# EAGLE board audio_board (EAGLE 6.3)
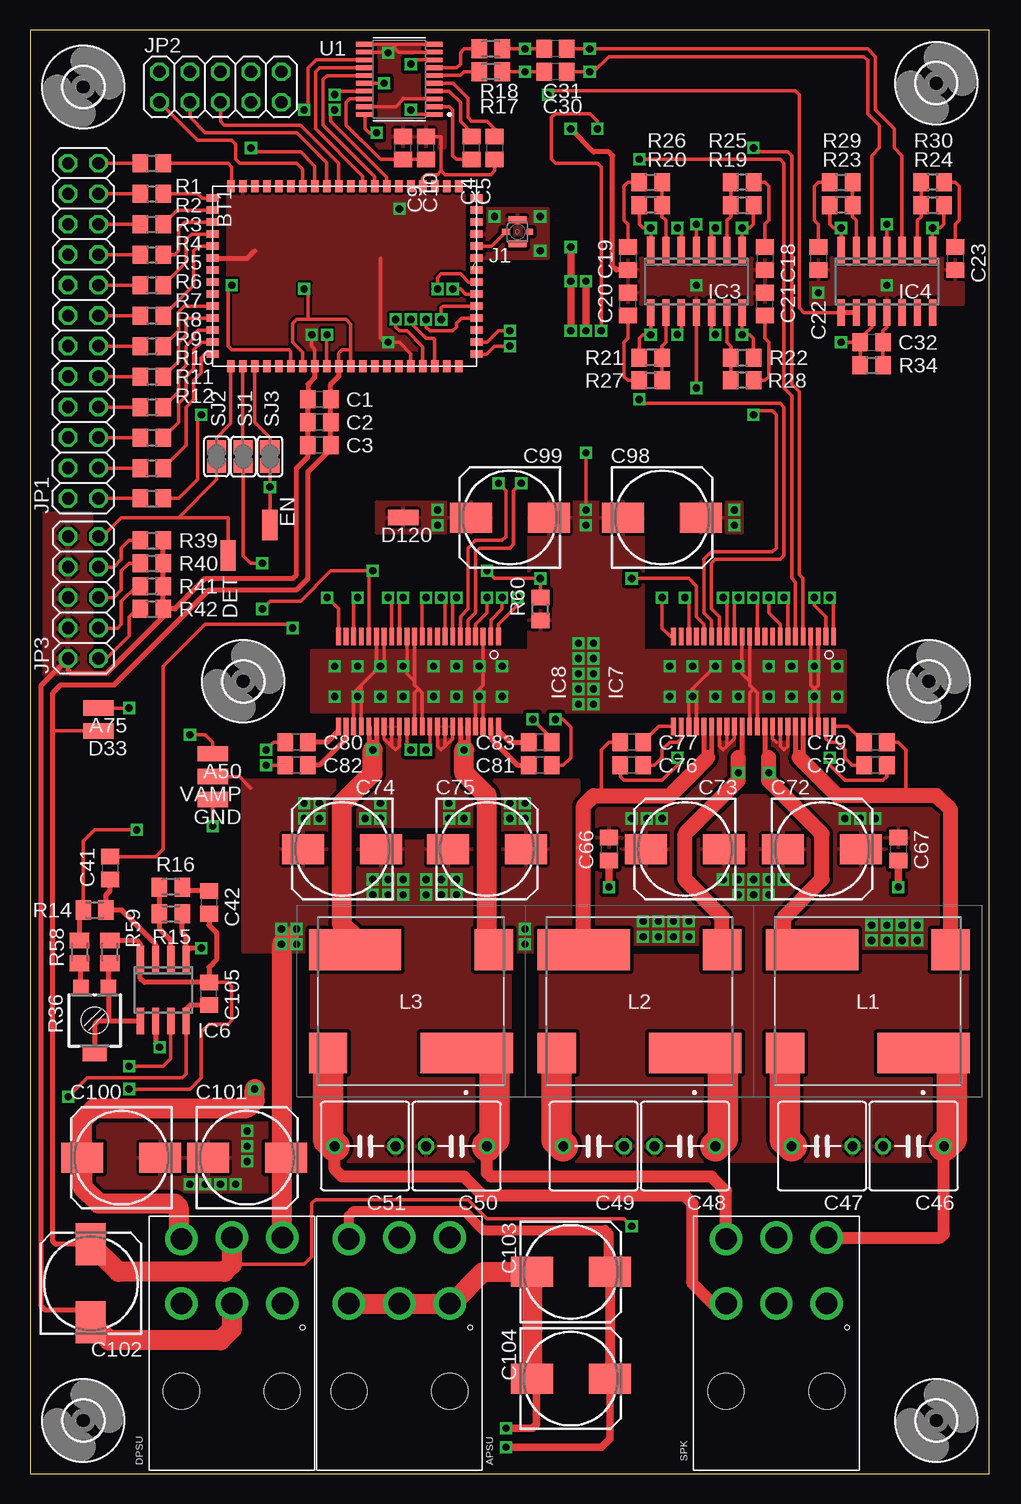
[diagram p6: board, top side]
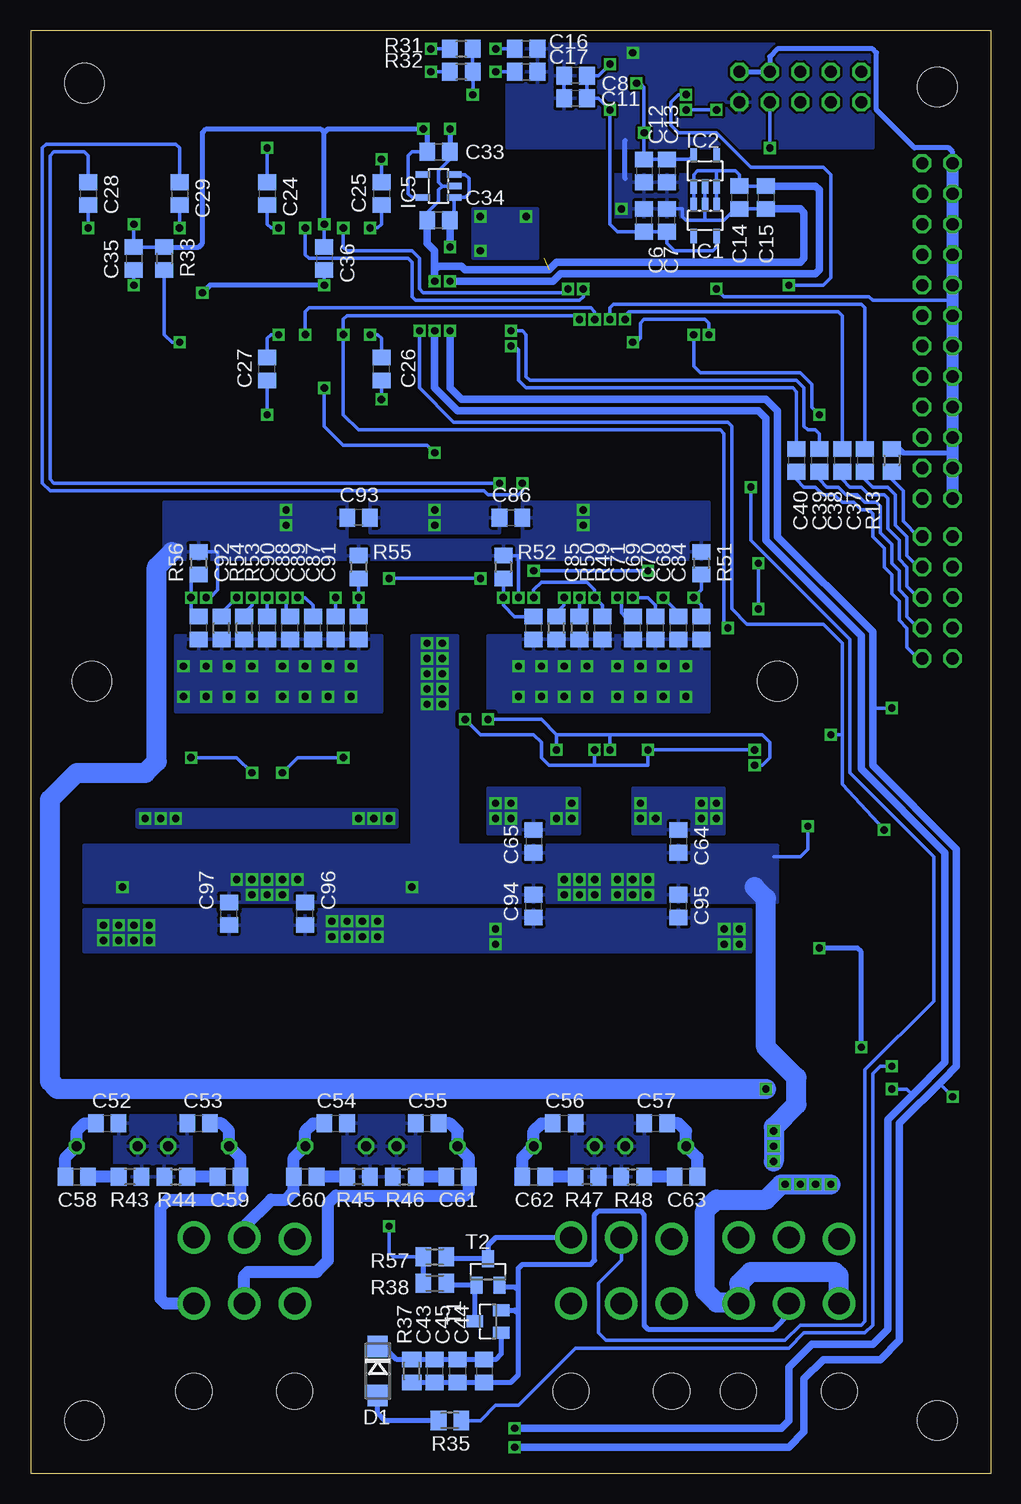
[diagram p7: board, bottom side, seen from below]

Size 79.99 x 120.32 mm. Coordinates in mm from the lower left corner, seen from the top.
Outline: 0,0 79.99,0 79.99,120.32 0,120.32 0,0
Copper layers (1*16): Top 0.035mm / dielectric 1.5mm / Bottom 0.035mm
Design rules "default": minimum track width 10mil, minimum drill 24mil, track to track 8mil, track to pad 8mil, pad to pad 8mil, via to via 8mil, smd to smd 8mil, copper to edge 40mil, drill to drill 8mil, minimum pad ring 10mil, minimum via ring 8mil, stop-mask expansion 4mil, vias tented up to drill 0mil, thermal gap 10mil

## Footprints (pad centres in the part's own frame; a part is rotated, then mirrored left to right if it is on the bottom)
SMD1,27-2,54 = smd 1.27 x 2.54: 1 0,0
5569_6P = drill 1.8: P$1 4.2,-5.5; P$2 0,-5.5; P$3 -4.2,-5.5; P$4 -4.2,-0.1; P$5 0,0; P$6 4.2,0 | hole 3: 4.2,-12.8; -4.2,-12.8
BTM875 = smd 1 x 0.635: 1 0,20.5; 2 0,19.5; 3 0,18.5; 4 0,17.5; 5 0,16.5; 6 0,15.5; 7 0,14.5; 8 0,13.5; 9 0,12.5; 10 0,11.5; 11 0,10.5; 12 0,9.5; 13 0,8.5; 14 0,7.5; 15 0,6.5; 16 0,5.5; 17 0,4.5; 18 0,3.5; 19 0,2.5; 20 0,1.5; 35 15,1.5; 36 15,2.5; 37 15,3.5; 38 15,4.5; 39 15,5.5; 40 15,6.5; 41 15,7.5; 42 15,8.5; 43 15,9.5; 44 15,10.5; 45 15,11.5; 46 15,12.5; 47 15,13.5; 48 15,14.5; 49 15,15.5; 50 15,16.5; 51 15,17.5; 52 15,18.5; 53 15,19.5; 54 15,20.5 | smd 0.635 x 1: 21 1,0; 22 2,0; 23 3,0; 24 4,0; 25 5,0; 26 6,0; 27 7,0; 28 8,0; 29 9,0; 30 10,0; 31 11,0; 32 12,0; 33 13,0; 34 14,0; 55 14,22; 56 13,22; 57 12,22; 58 11,22; 59 10,22; 60 9,22; 61 8,22; 62 7,22; 63 6,22; 64 5,22; 65 4,22; 66 3,22; 67 2,22; 68 1,22
C0805 = smd 1.3 x 1.5: 1 -0.95,0; 2 0.95,0
C050-075X075 = drill 0.813 octagon: 1 -2.54,0; 2 2.54,0
153CLV-0810 = smd 3.5 x 2.5: + 3.25,0; - -3.25,0
DO214AC = smd 1.8 x 1.7: A 2.05,0; C -2.05,0
3,3 = hole 3.3: 0,0
SOT23-5 = smd 0.55 x 1.2: 1 -0.95,-1.3; 2 0,-1.3; 3 0.95,-1.3; 4 0.95,1.3; 5 -0.95,1.3
SO14 = smd 0.6 x 2.2: 1 -3.81,-2.6; 2 -2.54,-2.6; 3 -1.27,-2.6; 4 0,-2.6; 5 1.27,-2.6; 6 2.54,-2.6; 7 3.81,-2.6; 8 3.81,2.6; 9 2.54,2.6; 10 1.27,2.6; 11 0,2.6; 12 -1.27,2.6; 13 -2.54,2.6; 14 -3.81,2.6
SO08 = smd 0.6 x 2.2: 1 -1.905,-2.6; 2 -0.635,-2.6; 3 0.635,-2.6; 4 1.905,-2.6; 5 1.905,2.6; 6 0.635,2.6; 7 -0.635,2.6; 8 -1.905,2.6
POWERPAD-TSSOP-44 = smd 1.45 x 0.4: 1 -3.75,6.668; 2 -3.75,6.032; 3 -3.75,5.397; 4 -3.75,4.763; 5 -3.75,4.128; 6 -3.75,3.493; 7 -3.75,2.857; 8 -3.75,2.223; 9 -3.75,1.587; 10 -3.75,0.953; 11 -3.75,0.318; 12 -3.75,-0.318; 13 -3.75,-0.953; 14 -3.75,-1.587; 15 -3.75,-2.223; 16 -3.75,-2.857; 17 -3.75,-3.493; 18 -3.75,-4.128; 19 -3.75,-4.763; 20 -3.75,-5.397; 21 -3.75,-6.032; 22 -3.75,-6.668; 23 3.75,-6.668; 24 3.75,-6.032; 25 3.75,-5.397; 26 3.75,-4.763; 27 3.75,-4.128; 28 3.75,-3.493; 29 3.75,-2.857; 30 3.75,-2.223; 31 3.75,-1.587; 32 3.75,-0.953; 33 3.75,-0.318; 34 3.75,0.318; 35 3.75,0.953; 36 3.75,1.587; 37 3.75,2.223; 38 3.75,2.857; 39 3.75,3.493; 40 3.75,4.128; 41 3.75,4.763; 42 3.75,5.397; 43 3.75,6.032; 44 3.75,6.668
CON-W.FL = smd 0.6 x 1.5: GND@0 -1,0; GND@1 1,0 | smd 0.5 x 0.55: GND@2 0,1.025 | smd 0.5 x 0.65: S 0,-0.975
2X12 = drill 1.016 octagon: 1 -13.97,-1.27; 2 -13.97,1.27; 3 -11.43,-1.27; 4 -11.43,1.27; 5 -8.89,-1.27; 6 -8.89,1.27; 7 -6.35,-1.27; 8 -6.35,1.27; 9 -3.81,-1.27; 10 -3.81,1.27; 11 -1.27,-1.27; 12 -1.27,1.27; 13 1.27,-1.27; 14 1.27,1.27; 15 3.81,-1.27; 16 3.81,1.27; 17 6.35,-1.27; 18 6.35,1.27; 19 8.89,-1.27; 20 8.89,1.27; 21 11.43,-1.27; 22 11.43,1.27; 23 13.97,-1.27; 24 13.97,1.27
2X05 = drill 1.016 octagon: 1 -5.08,-1.27; 2 -5.08,1.27; 3 -2.54,-1.27; 4 -2.54,1.27; 5 0,-1.27; 6 0,1.27; 7 2.54,-1.27; 8 2.54,1.27; 9 5.08,-1.27; 10 5.08,1.27
UA8014ALD = smd 7.7 x 3.4: 1 -4.65,4.3; 2 4.65,-4.3 | smd 3.2 x 3.4: 3 -6.9,-4.3; 4 6.9,4.3
R0805 = smd 1.3 x 1.5: 1 -0.95,0; 2 0.95,0
M0805 = smd 1.3 x 1.6: 1 -0.95,0; 2 0.95,0
RTRIM3314G = smd 1.3 x 1.3: 1 1.15,-2.75; 3 -1.15,-2.75 | smd 2 x 1.3: 2 0,2.75
SJ = smd 1.168 x 1.6: 1 -0.762,0; 2 0.762,0
SOT23 = smd 1 x 1.4: 1 -0.95,-1.1; 2 0.95,-1.1; 3 0,1.1
SOP65P640X120-20N = smd 1.57 x 0.41: 1 -2.87,2.925; 2 -2.87,2.275; 3 -2.87,1.625; 4 -2.87,0.975; 5 -2.87,0.325; 6 -2.87,-0.325; 7 -2.87,-0.975; 8 -2.87,-1.625; 9 -2.87,-2.275; 10 -2.87,-2.925; 11 2.87,-2.925; 12 2.87,-2.275; 13 2.87,-1.625; 14 2.87,-0.975; 15 2.87,-0.325; 16 2.87,0.325; 17 2.87,0.975; 18 2.87,1.625; 19 2.87,2.275; 20 2.87,2.925

## Placement (x,y rotation side)
A50  [SMD1,27-2,54]  15.24,60.01 90 top
A75  [SMD1,27-2,54]  5.71,63.82 90 top
APSU  [5569_6P]  30.8,19.68 0 top
BT1  [BTM875]  15.24,107.31 270 top
C1  100n  [C0805]  24.13,89.53 180 top
C2  1µ  [C0805]  24.13,87.63 180 top
C3  10µ  [C0805]  24.13,85.72 180 top
C4  2.2µ  [C0805]  36.83,110.49 90 top
C5  2.2µ  [C0805]  38.73,110.49 270 top
C6  100n  [C0805]  28.89,104.46 90 bottom
C7  10µ  [C0805]  26.99,104.46 90 bottom
C8  10µ  [C0805]  34.61,116.52 180 bottom
C9  10µ  [C0805]  31.11,110.49 90 top
C10  100n  [C0805]  33.02,110.49 90 top
C11  100n  [C0805]  34.61,114.62 180 bottom
C12  100n  [C0805]  28.89,108.58 270 bottom
C13  10µ  [C0805]  26.99,108.58 270 bottom
C14  10µ  [C0805]  20.95,106.36 270 bottom
C15  10µ  [C0805]  18.73,106.36 270 bottom
C16  2.2n  [C0805]  38.73,118.75 0 bottom
C17  2.2n  [C0805]  38.73,116.84 0 bottom
C18  10µ  [C0805]  61.28,101.28 270 top
C19  10µ  [C0805]  49.85,101.28 270 top
C20  10µ  [C0805]  49.85,97.47 90 top
C21  10µ  [C0805]  61.28,97.47 90 top
C22  10µ  [C0805]  65.72,101.28 270 top
C23  10µ  [C0805]  77.15,101.28 270 top
C24  10µ  [C0805]  60.33,106.68 270 bottom
C25  10µ  [C0805]  50.8,106.68 270 bottom
C26  10µ  [C0805]  50.8,92.08 90 bottom
C27  10µ  [C0805]  60.33,92.08 90 bottom
C28  10µ  [C0805]  75.25,106.68 270 bottom
C29  10µ  [C0805]  67.63,106.68 270 bottom
C30  10µ  [C0805]  43.81,116.84 180 top
C31  10µ  [C0805]  43.81,118.75 180 top
C32  100n  [C0805]  70.17,94.3 0 top
C33  10µ  [C0805]  46.04,110.17 0 bottom
C34  10µ  [C0805]  46.04,104.46 180 bottom
C35  100n  [C0805]  71.44,101.28 270 bottom
C36  100n  [C0805]  55.56,101.28 270 bottom
C37  10µ  [C0805]  10.48,84.45 270 bottom
C38  10µ  [C0805]  12.38,84.45 270 bottom
C39  10µ  [C0805]  14.29,84.45 270 bottom
C40  10µ  [C0805]  16.19,84.45 270 bottom
C41  10µ  [C0805]  6.67,50.48 270 top
C42  10µ  [C0805]  14.92,47.62 270 top
C43  10µ  [C0805]  46.35,8.57 270 bottom
C44  10µ  [C0805]  42.23,8.57 270 bottom
C45  10µ  [C0805]  44.45,8.57 270 bottom
C46  1µ  [C050-075X075]  73.66,27.3 180 top
C47  1µ  [C050-075X075]  66.04,27.3 180 top
C48  1µ  [C050-075X075]  54.61,27.3 180 top
C49  1µ  [C050-075X075]  46.99,27.3 180 top
C50  1µ  [C050-075X075]  35.56,27.3 180 top
C51  1µ  [C050-075X075]  27.94,27.3 180 top
C52  1n  [C0805]  73.66,29.21 0 bottom
C53  1n  [C0805]  66.04,29.21 0 bottom
C54  1n  [C0805]  54.61,29.21 0 bottom
C55  1n  [C0805]  46.99,29.21 0 bottom
C56  1n  [C0805]  35.56,29.21 0 bottom
C57  1n  [C0805]  27.94,29.21 0 bottom
C58  10n  [C0805]  76.2,24.77 0 bottom
C59  10n  [C0805]  63.5,24.77 0 bottom
C60  10n  [C0805]  57.15,24.77 0 bottom
C61  10n  [C0805]  44.45,24.77 0 bottom
C62  10n  [C0805]  38.1,24.77 0 bottom
C63  10n  [C0805]  25.4,24.77 0 bottom
C64  1µ  [C0805]  26.04,52.7 270 bottom
C65  1µ  [C0805]  38.1,52.7 270 bottom
C66  1µ  [C0805]  48.26,52.07 270 top
C67  1µ  [C0805]  72.39,52.07 270 top
C68  100n  [C0805]  26.04,70.48 90 bottom
C69  1µ  [C0805]  29.84,70.48 90 bottom
C70  47n  [C0805]  27.94,70.48 90 bottom
C71  1µ  [C0805]  32.38,70.48 270 bottom
C72  [153CLV-0810]  66.04,52.07 0 top
C73  [153CLV-0810]  54.61,52.07 180 top
C74  [153CLV-0810]  26.04,52.07 180 top
C75  [153CLV-0810]  38.1,52.07 0 top
C76  33n  [C0805]  50.16,59.05 180 top
C77  33n  [C0805]  50.16,60.96 180 top
C78  33n  [C0805]  70.48,59.05 180 top
C79  33n  [C0805]  70.48,60.96 180 top
C80  33n  [C0805]  22.23,60.96 180 top
C81  33n  [C0805]  42.55,59.05 180 top
C82  33n  [C0805]  22.23,59.05 180 top
C83  33n  [C0805]  42.55,60.96 180 top
C84  100n  [C0805]  24.13,70.48 90 bottom
C85  100n  [C0805]  38.1,70.48 90 bottom
C86  100n  [C0805]  40.01,79.69 0 bottom
C87  100n  [C0805]  54.61,70.48 90 bottom
C88  1µ  [C0805]  58.42,70.48 90 bottom
C89  47n  [C0805]  56.52,70.48 90 bottom
C90  1µ  [C0805]  60.33,70.48 270 bottom
C91  100n  [C0805]  52.7,70.48 90 bottom
C92  100n  [C0805]  66.04,70.48 90 bottom
C93  100n  [C0805]  52.7,79.69 180 bottom
C94  1µ  [C0805]  38.1,47.31 90 bottom
C95  1µ  [C0805]  26.04,47.31 90 bottom
C96  1µ  [C0805]  57.15,46.67 90 bottom
C97  1µ  [C0805]  63.5,46.67 90 bottom
C98  FK 470/16 AP  [153CLV-0810]  52.7,79.69 0 top
C99  FK 470/16 AP  [153CLV-0810]  40.01,79.69 180 top
C100  FK 470/16 AP  [153CLV-0810]  7.62,26.35 180 top
C101  [153CLV-0810]  18.1,26.35 0 top
C102  FK-V 1,0M 6,3  [153CLV-0810]  5.08,15.88 90 top
C103  ECC MZL100ARA681  [153CLV-0810]  45.09,16.83 0 top
C104  ECC MZL100ARA681  [153CLV-0810]  45.09,7.94 0 top
C105  100n  [C0805]  14.92,40.01 90 top
D1  [DO214AC]  51.12,8.57 270 bottom
D33  [SMD1,27-2,54]  5.71,61.91 90 top
D120  [SMD1,27-2,54]  31.11,79.69 90 top
DET  [SMD1,27-2,54]  16.51,76.52 0 top
DPSU  [5569_6P]  16.83,19.68 0 top
EN  [SMD1,27-2,54]  20,79.06 180 top
GND  [SMD1,27-2,54]  15.24,56.2 90 top
H1  MOUNT-HOLE3.3  [3,3]  17.78,66.04 0 top
H2  MOUNT-HOLE3.3  [3,3]  74.93,66.04 0 top
H3  MOUNT-HOLE3.3  [3,3]  4.45,4.45 0 top
H4  MOUNT-HOLE3.3  [3,3]  75.56,4.45 0 top
H5  MOUNT-HOLE3.3  [3,3]  4.45,115.57 0 top
H6  MOUNT-HOLE3.3  [3,3]  75.56,115.89 0 top
IC1  LP2981-33DBVR  [SOT23-5]  23.81,104.46 180 bottom
IC2  LP2981-33DBVR  [SOT23-5]  23.81,108.58 0 bottom
IC3  TS914  [SO14]  55.56,99.38 180 top
IC4  TS914  [SO14]  71.44,99.38 180 top
IC5  LP2981M5  [SOT23-5]  46.04,107.31 90 bottom
IC6  LM358D  [SO08]  11.11,40.32 180 top
IC7  [POWERPAD-TSSOP-44]  60.33,66.04 270 top
IC8  [POWERPAD-TSSOP-44]  32.38,66.04 270 top
J1  CON-HIROSE-COAXIAL-W.FL  [CON-W.FL]  40.64,103.5 270 top
JP1  IO  [2X12]  4.45,95.25 270 top
JP2  SPI  [2X05]  15.88,115.57 180 top
JP3  AUX  [2X05]  4.45,73.03 270 top
L1  [UA8014ALD]  69.85,39.37 180 top
L2  [UA8014ALD]  50.8,39.37 180 top
L3  [UA8014ALD]  31.75,39.37 180 top
R1  [R0805]  10.16,109.22 0 top
R2  [R0805]  10.16,106.68 0 top
R3  [R0805]  10.16,104.14 0 top
R4  [R0805]  10.16,101.6 0 top
R5  [R0805]  10.16,99.06 0 top
R6  [R0805]  10.16,96.52 0 top
R7  [R0805]  10.16,93.98 0 top
R8  [R0805]  10.16,91.44 0 top
R9  [R0805]  10.16,88.9 0 top
R10  [R0805]  10.16,86.36 0 top
R11  [R0805]  10.16,83.82 0 top
R12  [R0805]  10.16,81.28 0 top
R13  1M  [R0805]  8.26,84.45 270 bottom
R14  100k  [M0805]  5.4,46.99 180 top
R15  100k  [M0805]  11.75,46.67 180 top
R16  1k  [M0805]  11.75,48.9 0 top
R17  470  [M0805]  38.42,116.84 0 top
R18  470  [M0805]  38.42,118.75 0 top
R19  10k  [R0805]  59.37,105.73 0 top
R20  10k  [R0805]  51.75,105.73 180 top
R21  10k  [R0805]  51.75,93.03 180 top
R22  10k  [R0805]  59.37,93.03 0 top
R23  10k  [R0805]  67.63,105.73 180 top
R24  10k  [R0805]  75.25,105.73 0 top
R25  10k  [R0805]  59.37,107.63 180 top
R26  10k  [R0805]  51.75,107.63 0 top
R27  10k  [R0805]  51.75,91.12 0 top
R28  10k  [R0805]  59.37,91.12 180 top
R29  10k  [R0805]  67.63,107.63 0 top
R30  10k  [R0805]  75.25,107.63 180 top
R31  100k  [R0805]  44.13,118.75 180 bottom
R32  100k  [R0805]  44.13,116.84 180 bottom
R33  100k  [R0805]  68.9,101.28 270 bottom
R34  100k  [R0805]  70.17,92.39 0 top
R35  100  [M0805]  45.09,4.45 0 bottom
R36  100k  [RTRIM3314G]  5.4,37.78 180 top
R37  1M  [M0805]  48.26,8.57 270 bottom
R38  10k  [M0805]  46.35,15.88 180 bottom
R39  100k  [R0805]  10.16,77.79 0 top
R40  100k  [R0805]  10.16,75.88 0 top
R41  100k  [R0805]  10.16,73.98 0 top
R42  100k  [R0805]  10.16,72.07 0 top
R43  3.3  [R0805]  71.75,24.77 180 bottom
R44  3.3  [R0805]  67.94,24.77 0 bottom
R45  3.3  [R0805]  52.7,24.77 180 bottom
R46  3.3  [R0805]  48.9,24.77 0 bottom
R47  3.3  [R0805]  33.66,24.77 180 bottom
R48  3.3  [R0805]  29.84,24.77 0 bottom
R49  30k  [R0805]  34.29,70.48 90 bottom
R50  22k  [R0805]  36.2,70.48 90 bottom
R51  3.3  [R0805]  24.13,75.88 270 bottom
R52  3.3  [R0805]  40.64,75.56 270 bottom
R53  30k  [R0805]  62.23,70.48 90 bottom
R54  22k  [R0805]  64.14,70.48 90 bottom
R55  3.3  [R0805]  52.7,75.56 270 bottom
R56  3.3  [R0805]  66.04,75.88 270 bottom
R57  10k  [M0805]  46.35,18.1 180 bottom
R58  22k  [M0805]  4.13,43.5 90 top
R59  100k  [M0805]  6.67,43.5 270 top
R60  100k  [R0805]  42.55,72.07 90 top
SJ1  [SJ]  17.78,84.77 270 top
SJ2  [SJ]  15.56,84.77 90 top
SJ3  [SJ]  20,84.77 270 top
SPK  [5569_6P]  62.23,19.68 0 top
T1  2N7002  [SOT23]  41.91,12.7 90 bottom
T2  2N7002  [SOT23]  41.91,16.83 0 bottom
U1  PCM5102APWR  [SOP65P640X120-20N]  30.8,116.2 180 top
VAMP  [SMD1,27-2,54]  15.24,58.1 90 top

## Tracks (layer width: path | path; a pad name or v marks a point on that pad's centre or on a via)
A25BIAS  (via drill 0.6)
  Top 0.305: IC4.8 64.51,96.78 64.14,97.16 64.14,114.94 63.82,115.25 43.5,115.25 v43.18,114.94
  Top 0.406: IC4.9 IC4.8
  Bottom 0.305: v43.18,114.94 R32.1 R31.1
A33DAC  (via drill 0.61)
  Top 0.305: U1.8 32.1,117.83 v31.75,117.47 | U1.1 32.13,113.28 v31.75,113.67
  Bottom 0.305: IC1.5 22.86,102.23 23.18,101.92 26.35,101.92 26.99,102.55 C7.1 C6.1 31.12,103.51 31.75,104.14 v31.75,113.67 32.7,114.62 C11.1 C8.1 32.7,116.52 v31.75,117.47
A50  (via drill 0.6, 0.61)
  Top 0.305: IC4.4 v71.44,104.14 | IC3.4 v55.56,104.14 | v47.31,112.08 47.31,112.71 46.67,113.35 43.81,113.35 43.5,113.03 43.5,109.54 43.81,109.22 47.31,109.22 47.62,108.9 v47.62,95.25 | v8.89,53.66 5.4,53.66 4.45,52.7 R14.2 | A50.1 15.24,60.96 14.61,61.59 v13.34,61.59
  Top 0.406: R58.2 4.13,46.67 R14.2
  Bottom 0.305: R33.1 C35.1 v71.44,104.14 | C36.1 v55.56,104.14 | IC5.5 48.26,106.36 48.58,106.68 48.58,109.86 48.26,110.17 C33.1 | 12.38,61.59 12.38,69.22 13.97,70.8 20.32,70.8 21.59,72.07 21.59,87.31 21.91,87.63 44.77,87.63 47.62,90.49 v47.62,95.25 | 12.38,61.59 12.38,57.47 v8.89,53.66 | v13.34,61.59 12.38,61.59
  Bottom 0.406: v55.56,104.14 55.56,111.76 | 55.56,111.76 55.24,112.08 v47.31,112.08 46.99,111.76 C33.1 | R33.1 66.04,102.23 65.72,102.55 65.72,111.76 65.41,112.08 55.88,112.08 55.56,111.76
A75  (via drill 0.6)
  Top 0.305: IC6.8 13.02,33.34 12.7,33.02 4.76,33.02 v3.17,31.43 | A75.1 v8.26,63.82
  Top 0.406: C105.1 13.34,39.05 13.02,38.73 IC6.8
  Top 0.61: C104.+ 48.34,2.93 47.62,2.22 v39.69,2.22 | v45.09,95.25 v45.09,99.38 v45.09,102.23
  Top 0.813: APSU.P$4 26.6,21.52 26.99,21.91 36.2,21.91 37.78,20.32 47.94,20.32 48.26,20 48.26,16.9 C103.+ C104.+
  Bottom 0.305: 22.86,108.58 21.27,108.58 20.95,108.27 C14.1 C15.1 | 22.86,108.58 24.45,108.58 24.76,108.27 IC2.1 IC1.3 | 22.86,108.58 IC2.3 IC1.1 | v3.17,31.43 4.13,32.38 4.13,32.7 3.97,32.86 | C34.1 44.74,104.81 IC5.1 43.81,106.36 43.5,106.68 43.5,107.95 43.81,108.27 IC5.3 | 9.84,63.82 v8.26,63.82
  Bottom 0.61: v39.69,2.22 16.83,2.22 15.56,3.49 15.56,7.94 13.97,9.53 9.21,9.53 7.62,11.11 7.62,29.21 3.97,32.86 2.86,33.97 2.86,52.07 9.84,59.05 9.84,63.82 9.84,70.17 17.78,78.11 17.78,88.58 18.73,89.53 44.13,89.53 45.09,90.49 v45.09,95.25 | v45.09,99.38 36.51,99.38 35.88,100.01 14.61,100.01 14.29,100.33 14.29,107 14.61,107.31 C15.1 | C34.1 v45.09,102.24 v45.09,102.23
AMP_EN  (via drill 0.6)
  Top 0.305: IC7.18 56.2,70.8 55.56,71.44 55.56,73.98 54.93,74.61 v50.16,74.61 | v38.1,75.25 38.73,74.61 v42.55,74.61 R60.2 | IC8.18 28.26,74.93 v28.57,75.25 25.08,75.25 22.54,72.71 20,72.71 v19.37,72.07 | v19.37,75.88 18.41,75.88 17.78,76.52 SJ1.2
  Bottom 0.305: v50.16,74.61 v42.55,74.61 | v38.1,75.25 v28.57,75.25 | v19.37,72.07 v19.37,75.88
AMP_LN  (via drill 0.6)
  Top 0.305: IC7.17 56.83,71.12 56.2,71.75 56.2,76.2 56.83,76.83 61.91,76.83 62.23,77.15 62.23,88.27 61.91,88.58 60.64,88.58 v60.33,88.27
  Bottom 0.305: C27.1 v60.33,88.27
AMP_LP  (via drill 0.6)
  Top 0.305: IC7.16 57.47,71.44 56.83,72.07 56.83,75.88 57.15,76.2 62.55,76.2 62.87,76.52 62.87,88.9 62.55,89.22 51.12,89.22 v50.8,89.53
  Bottom 0.305: C26.1 v50.8,89.53
AMP_RN  (via drill 0.6)
  Top 0.305: v50.8,109.54 62.55,109.54 62.87,109.22 62.87,90.49 63.5,89.85 63.5,74.61 63.82,74.3 IC7.6
  Bottom 0.305: v50.8,109.54 C25.1
AMP_RP  (via drill 0.6)
  Top 0.305: v60.33,110.49 60.64,110.17 63.18,110.17 63.5,109.86 63.5,90.81 64.14,90.17 64.14,74.93 64.45,74.61 IC7.5
  Bottom 0.305: C24.1 v60.33,110.49
AMP_SN  (via drill 0.6)
  Top 0.305: IC8.6 35.88,71.44 36.51,72.07 36.51,77.15 37.15,77.79 39.37,77.79 39.69,78.11 39.69,81.92 v39.05,82.55
  Bottom 0.305: v39.05,82.55 39.05,81.92 39.37,81.6 41.91,81.6 42.23,81.92 78.42,81.92 79.06,82.55 79.06,110.49 78.74,110.81 67.94,110.81 67.63,110.49 C29.1
AMP_SP  (via drill 0.6)
  Top 0.305: IC8.5 36.51,71.12 37.15,71.75 37.15,76.83 37.47,77.15 40.01,77.15 40.32,77.47 40.32,81.92 v40.96,82.55
  Bottom 0.305: v40.96,82.55 78.11,82.55 78.42,82.87 78.42,109.86 78.11,110.17 75.56,110.17 75.25,109.86 C28.1
AUX_LN  (via drill 0.6)
  Top 0.305: BT1.55 38.07,93.31 38.73,93.98 v40.01,93.98
  Bottom 0.305: v40.01,93.98 39.69,93.98 39.37,93.66 39.37,91.12 38.73,90.49 16.51,90.49 16.19,90.17 C40.1
AUX_LP  (via drill 0.6)
  Top 0.305: BT1.56 38.12,94.31 39.05,95.25 v40.01,95.25
  Bottom 0.305: v40.01,95.25 39.05,95.25 38.73,94.93 38.73,91.44 38.42,91.12 16.19,91.12 15.56,90.49 15.56,87.31 15.24,87 14.61,87 14.29,86.68 C39.1
AUX_RN  (via drill 0.6)
  Top 0.305: BT1.51 32.74,93.94 31.43,95.25 30.8,95.25 30.48,95.57 v30.48,96.2
  Bottom 0.305: C38.1 12.38,96.52 12.7,96.84 30.16,96.84 30.48,96.52 v30.48,96.2
AUX_RP  (via drill 0.6)
  Top 0.305: BT1.52 33.74,94.53 33.66,94.61 33.02,94.61 31.75,95.89 v31.75,96.2
  Bottom 0.305: C37.1 10.48,97.16 10.79,97.47 31.43,97.47 31.75,97.16 v31.75,96.2
D33  (via drill 0.6)
  Top 0.305: 23.18,96.2 23.18,98.42 v22.86,98.74 | 16.83,17.46 22.86,17.46 23.5,18.1 23.5,22.54 23.81,22.86 36.51,22.86 38.1,21.27 49.53,21.27 v50.16,20.64 | BT1.41 22.74,93.47 21.91,94.3 21.91,95.89 22.23,96.2 23.18,96.2 | BT1.45 26.74,93.66 | 26.74,93.66 26.74,95.81 26.35,96.2 23.18,96.2 | BT1.44 25.74,93.37 26.04,93.66 26.74,93.66 | D33.1 1.91,61.91
  Top 0.406: C102.+ 2.15,19.12 1.91,19.37 1.91,61.91 1.91,65.09 2.54,65.72 6.99,65.72 14.92,73.66 22.23,73.66 23.18,74.61 23.18,83.5 24.77,85.09 24.77,85.41 C3.1 | C3.1 | C3.1 C2.1 C1.1 25.08,90.8 25.74,91.46 BT1.44
  Top 1.676: DPSU.P$5 16.83,17.46 16.19,16.83 7.38,16.83 C102.+
  Bottom 0.305: 3.17,98.11 3.49,97.79 | 3.17,97.79 9.84,97.79 10.16,98.11 22.23,98.11 v22.86,98.74 | v50.16,20.64 50.16,18.41 49.85,18.1 R57.2
  Bottom 0.406: JP1.1 3.17,110.17 3.49,110.49 6.35,110.49 9.53,113.67 9.53,118.43 9.84,118.75 17.78,118.75 18.41,118.11 JP2.3 JP2.1 | R13.1 7.62,85.41 7.3,85.09 3.49,85.09 3.17,85.41 | R38.2 R57.2
  Bottom 1.016: JP1.23 JP1.21 3.17,85.41 JP1.19 JP1.17 JP1.15 JP1.13 JP1.11 3.17,97.79 3.17,98.11 JP1.9 JP1.7 JP1.5 JP1.3 JP1.1
D33DAC  (via drill 0.61)
  Top 0.305: U1.20 27.93,112.09 28.26,111.76 v28.89,111.76 | U1.16 v29.52,115.88 v29.53,115.89
  Bottom 0.305: IC2.5 25.11,109.53 C13.1 C12.1 v28.89,111.76 28.89,115.57 29.21,115.89 v29.53,115.89
D120  (via drill 0.6)
  Top 0.305: IC8.2 38.42,71.12 39.37,72.07 v39.37,73.03 | IC7.2 66.36,71.44 65.41,72.39 v65.41,73.03
  Top 1.676: DPSU.P$4 12.38,19.83 12.38,22.23 12.06,22.54 5.71,22.54 4.37,23.89 C100.+ 4.37,29.45 5.4,30.48 18.1,30.48 18.73,31.11 v18.73,32.07
  Bottom 0.305: v39.37,73.03 39.37,76.52 R52.1 | v65.41,73.03 65.09,73.03 64.45,73.66 64.45,76.83 R56.1
  Bottom 1.676: v18.73,32.07 77.79,32.07 78.42,32.7 78.42,56.2 76.2,58.42 70.48,58.42 69.53,59.37 69.53,75.56 68.26,76.83
  other vias: 33.97,80.33 33.97,79.06 58.74,80.33 58.74,79.06
  pour Top (isolate 0.305): 38.42,78.42 38.42,80.96 28.89,80.96 28.89,78.42
  pour Top (isolate 0.305): 59.37,78.42 59.37,80.96 54.29,80.96 54.29,78.42
  pour Bottom (isolate 0.305): 23.5,76.2 68.9,76.2 68.9,80.96 53.66,80.96 53.66,77.79 39.05,77.79 39.05,80.96 23.5,80.96
DETECT
  Top 0.305: SJ2.1 15.56,82.87 12.38,79.69 | 12.38,79.69 7.62,79.69 6.03,78.11 JP3.2 | DET.1 16.51,79.69 12.38,79.69
  Bottom 0.305: JP3.2 6.03,78.11 7.3,79.38 7.3,81.92 8.26,82.87 8.26,83.19
  Bottom 0.406: 8.26,83.19 R13.2
EN  (via drill 0.6)
  Top 0.305: SJ3.2 v20,82.23 EN.1
  Bottom 0.305: APSU.P$5 30.8,17.78 32.7,15.88 32.7,11.75 32.07,11.11 17.14,11.11 15.88,12.38 10.79,12.38 10.48,12.7 10.48,33.66 4.76,39.37 4.76,51.44 11.75,58.42 11.75,69.53 20,77.79 v20,82.23
GND  (via drill 0.6, 0.61)  (1 unrouted)
  Top 0.305: IC4.11 71.44,95.57 71.12,95.25 C32.2 R34.2 | IC8.26 27.62,65.72 | IC8.25 26.99,65.09 27.62,65.72 | IC8.34 32.7,65.09 32.38,65.41 | IC8.33 32.07,65.09 32.38,65.41 | IC8.42 37.78,65.09 37.47,65.41 | IC8.41 37.15,65.09 37.47,65.41 | IC7.25 54.93,65.09 55.24,65.41 | IC7.26 55.56,65.09 55.24,65.41 | IC7.33 60.01,65.09 60.33,65.41 | IC7.34 60.64,65.09 60.33,65.41 | IC7.41 65.09,65.09 65.41,65.41 | IC7.42 65.72,65.09 65.41,65.41 | IC8.17 28.89,66.99 | 28.89,66.99 27.62,65.72 | IC8.16 29.53,67.63 28.89,66.99 | IC8.3 37.78,65.72 37.47,65.41 | IC8.12 32.07,66.04 | 32.07,66.04 32.07,65.72 32.38,65.41 | IC8.13 31.43,66.67 32.07,66.04 | IC7.3 65.72,65.72 65.41,65.41 | IC7.4 65.09,65.72 65.41,65.41 | IC7.12 60.01,66.04 | 60.01,66.04 60.01,65.72 60.33,65.41 | IC7.13 59.37,66.67 60.01,66.04 | 57.47,67.63 55.24,65.41 | U1.11 30.41,119.13 30.48,119.06 | U1.12 29.9,118.48 30.32,118.9 | 30.32,118.9 30.48,119.06 | U1.10 30.55,119.13 30.48,119.06 | U1.9 30.75,118.48 30.32,118.9 | U1.3 31.15,114.58 | 31.15,114.58 31.11,114.62 | U1.19 30.5,113.93 31.15,114.58 | v8.26,32.07 13.34,32.07 14.29,33.02 14.29,36.83 14.92,37.47 16.51,37.47 16.83,37.78 16.83,40.64 16.51,40.96 C105.2 | C5.2 38.73,108.58 38.42,108.27 34.61,108.27 34.29,108.58 | 34.29,108.58 34.29,111.44 C10.2 | BT1.4 32.74,107.99 33.02,108.27 33.97,108.27 34.29,108.58 | v46.35,85.09 v46.35,80.33 | 55.56,96.52 v55.56,90.49 | BT1.42 23.74,93.73 23.5,93.98 v23.5,94.93 | BT1.50 31.74,93.36 30.8,94.3 v29.84,94.3 29.53,94.3 29.21,94.61 29.21,101.28 | 41.91,7.94 C104.- | GND.1 v15.24,53.98
  Top 0.406: C102.- 4.76,12.94 4.76,13.65 1.27,13.65 0.95,13.97 0.95,65.72 JP3.9 3.17,66.99 3.49,66.67 6.35,66.67 11.11,71.44 R42.2 | R42.2 R41.2 R40.2 R39.2 | BT1.42 23.74,91.37 23.18,90.81 C1.2 C2.2 C3.2 23.18,84.77 22.23,83.82 22.23,74.93 21.91,74.61 14.61,74.61 12.06,72.07 R42.2 | R59.1 8.89,44.45 9.21,44.13 IC6.4 9.21,41.27 9.53,40.95 C105.2 14.92,42.23 15.56,42.86 15.56,45.09 14.92,45.72 C42.2 | BT1.26 18.13,101.31 18.73,101.92 | C19.2 48.89,100.33 48.58,100.65 48.58,109.86 48.26,110.17 46.99,110.17 v45.09,112.08 | IC3.11 55.56,96.52
  Top 0.61: C66.2 v48.26,48.9 | C67.2 v72.39,48.9 | v39.69,3.81 41.91,3.81 42.23,4.13 C44.2 41.91,7.94 | v46.35,95.25 v46.35,99.38
  Top 1.676: DPSU.P$2 16.83,12.06 15.88,11.11 6.59,11.11 C102.- | APSU.P$3 APSU.P$2 APSU.P$1 35.14,14.19 37.78,16.83 C103.- C104.-
  Bottom 0.305: C15.2 C14.2 21.27,105.41 22.23,104.46 23.81,104.46 | IC2.2 IC1.2 23.81,104.46 | C11.2 C8.2 | C36.2 v55.56,99.06 | C35.2 v71.44,99.06 | v8.26,32.07 6.99,32.07 6.51,31.59 | IC5.2 45.72,107.31 | 45.72,107.31 46.04,107 46.04,106.05 46.99,105.09 C34.2 | C33.2 45.09,109.53 46.04,108.58 46.04,107.63 45.72,107.31 | 23.81,104.46 25.4,104.46 25.72,104.78 25.72,105.41 C7.2 | v55.56,90.49 55.56,87.31 53.98,85.72 46.99,85.72 v46.35,85.09 | v29.84,94.3 29.53,94.3 29.21,94.61 29.21,95.89 28.89,96.2 23.81,96.2 23.5,95.89 v23.5,94.93 | C44.2 42.23,7.3 | v15.24,53.98 15.24,52.07 15.88,51.44 18.1,51.44
  Bottom 0.406: DPSU.P$2 16.83,13.34 18.1,12.06 28.57,12.06 28.89,12.38 28.89,21.59 29.21,21.91 32.7,21.91 33.02,21.59 33.02,17.78 33.34,17.46 39.05,17.46 39.37,17.14 39.37,15.24 | R37.2 C43.2 C45.2 C44.2 40,7.62 39.37,8.26 39.37,13.34 | 39.37,13.34 39.37,15.24 | 39.37,15.24 39.69,15.56 40.79,15.56 T2.2 | T1.2 39.69,13.65 39.37,13.34 | C15.2 | v45.09,112.08 C33.2 | v55.56,99.06 65.09,99.06 v65.72,98.42 | 30.48,107.95 30.48,111.12
  Bottom 0.61: v39.69,3.81 17.46,3.81 16.83,4.45 16.83,8.89 14.92,10.79 9.84,10.79 8.57,12.06 8.57,29.53 6.51,31.59 3.81,34.29 3.81,51.75 10.79,58.74 10.79,69.85 18.73,77.79 18.73,87.95 19.37,88.58 44.45,88.58 46.35,90.49 v46.35,95.25 | v46.35,99.38 46.35,100.33 | 46.35,100.33 46.04,100.65 44.13,100.65 43.81,100.33 36.83,100.33 36.2,100.97 15.88,100.97 15.56,101.28 15.56,105.09 15.88,105.41 C15.2 | C34.2 46.99,102.55 46.35,101.92 46.35,100.33
  Bottom 1.676: v13.34,24.13 17.46,24.13 18.73,22.86 22.86,22.86 23.81,21.91 23.81,15.24 22.86,14.29 21.13,14.29 DPSU.P$1 20.95,14.26 20.95,15.88 20,16.83 13.02,16.83 12.7,16.51 12.7,14.26 DPSU.P$3 | v18.1,26.04 18.1,28.89 16.19,30.8 16.19,33.02 18.73,35.56 18.73,47.94 19.68,48.9
  other vias: 45.72,66.67 46.99,66.67 46.99,65.41 45.72,65.41 28.57,49.53 29.84,49.53 31.11,49.53 33.02,49.53 34.29,49.53 35.56,49.53 35.56,48.26 34.29,48.26 33.02,48.26 31.11,48.26 29.84,48.26 28.57,48.26 57.78,49.53 59.05,49.53 61.59,49.53 62.87,49.53 60.33,49.53 60.33,48.26 61.59,48.26 59.05,48.26 25.4,67.31 25.4,64.77 27.3,64.77 29.21,64.77 31.11,64.77 33.66,64.77 35.56,64.77 37.47,64.77 39.37,64.77 39.37,67.31 37.47,67.31 35.56,67.31 33.66,67.31 31.11,67.31 29.21,67.31 27.3,67.31 59.05,67.31 61.59,67.31 63.5,67.31 65.41,67.31 67.31,67.31 67.31,64.77 65.41,64.77 63.5,64.77 61.59,64.77 59.05,64.77 57.15,64.77 55.24,64.77 53.34,64.77 53.34,67.31 55.24,67.31 57.15,67.31 38.73,104.78 42.55,104.78 42.55,101.92 46.35,79.06 18.1,27.3 18.1,28.57 17.14,24.13 15.88,24.13 14.61,24.13 29.84,118.43 30.8,105.41 45.72,67.94 46.99,67.94 46.99,64.14 45.72,64.14 45.72,69.22 46.99,69.22
  pour Top (isolate 0.305): 49.21,101.28 61.91,101.28 61.91,97.47 49.21,97.47
  pour Top (isolate 0.305): 65.09,101.28 77.79,101.28 77.79,97.47 65.09,97.47
  pour Top (isolate 0.305): 27.3,46.99 36.83,46.99 36.83,52.7 27.3,52.7
  pour Top (isolate 0.305): 57.78,46.99 62.87,46.99 65.41,49.53 65.41,53.34 62.23,56.52 58.42,56.52 55.24,53.34 55.24,49.53
  pour Top (isolate 0.305): 23.5,63.5 67.94,63.5 67.94,68.58 23.5,68.58
  pour Bottom (isolate 0.305): 17.78,52.39 44.45,52.39 44.45,69.85 48.26,69.85 48.26,52.39 75.56,52.39 75.56,47.62 17.78,47.62
  pour Bottom (isolate 0.305): 23.5,69.85 41.91,69.85 41.91,63.5 23.5,63.5
  pour Bottom (isolate 0.305): 50.8,69.85 67.94,69.85 67.94,63.5 50.8,63.5
  pour Top (isolate 0.305): 58.42,46.99 62.23,46.99 62.23,43.18 78.11,43.18 78.11,26.04 42.55,26.04 42.55,43.18 58.42,43.18
  pour Top (isolate 0.305): 27.3,46.99 36.83,46.99 36.83,45.72 40.01,45.72 40.01,26.04 23.5,26.04 23.5,45.72 27.3,45.72
  pour Bottom (isolate 0.305): 28.57,29.84 34.92,29.84 34.92,24.13 28.57,24.13
  pour Bottom (isolate 0.305): 47.62,29.84 53.98,29.84 53.98,24.13 47.62,24.13
  pour Bottom (isolate 0.305): 66.67,29.84 73.03,29.84 73.03,24.13 66.67,24.13
  pour Top (isolate 0.305): 28.89,120.02 32.7,120.02 32.7,112.71 34.61,112.71 34.61,110.49 28.89,110.49
  pour Top (isolate 0.305): 36.83,103.82 37.78,103.82 37.78,105.41 43.18,105.41 43.18,101.28 36.83,101.28
  pour Bottom (isolate 0.305): 37.78,101.28 43.18,101.28 43.18,105.41 37.78,105.41
  pour Top (isolate 0.305): 41.59,80.96 51.12,80.96 51.12,63.5 41.59,63.5
  pour Bottom (isolate 0.305): 40.96,78.42 51.75,78.42 51.75,80.96 40.96,80.96
  pour Top (isolate 0.305): 5.08,29.21 21.27,29.21 21.27,23.5 5.08,23.5
  pour Top: 16.51,107.63 36.2,107.63 36.2,93.66 16.51,93.66
  pour Top: 0.64,80.01 5.08,80.01 5.08,66.67 0.64,66.67
  pour Bottom: 25.4,108.27 31.75,108.27 31.75,104.78 25.4,104.78
  pour Bottom: 9.84,120.33 40.32,120.33 40.32,110.49 9.84,110.49
LED0
  Top 0.305: R1.2 16.51,109.22 16.83,108.9 16.83,107.4 BT1.20
LED1
  Top 0.305: R2.2 13.97,106.68 14.34,106.31 BT1.21
LED2
  Top 0.305: BT1.22 12.29,105.31 R3.2
LINE_LN
  Top 0.305: R42.1 8.89,72.07 8.26,71.44 8.26,69.85 6.35,67.94 JP3.10
  Bottom 0.305: JP3.10 6.03,67.94 6.99,68.9 6.99,70.48 7.62,71.12 7.62,72.71 8.26,73.34 8.26,74.93 8.89,75.56 8.89,77.15 9.84,78.11 9.84,80.01 10.16,80.33 10.79,80.33 11.43,80.96 12.38,80.96 13.02,81.6 13.97,81.6 14.61,82.23 15.56,82.23 16.19,82.87 C40.2
LINE_LP
  Top 0.305: R41.1 8.89,73.98 7.62,72.71 7.62,70.8 7.3,70.48 JP3.8
  Bottom 0.305: JP3.8 6.03,70.48 6.99,71.44 6.99,73.03 7.62,73.66 7.62,75.25 8.26,75.88 8.26,77.47 9.21,78.42 9.21,80.64 9.53,80.96 10.48,80.96 11.11,81.6 12.06,81.6 12.7,82.23 13.65,82.23 14.29,82.87 C39.2
LINE_RN
  Top 0.305: R40.1 8.26,75.88 7.62,75.25 7.62,73.66 6.99,73.03 JP3.6
  Bottom 0.305: JP3.6 6.03,73.03 6.99,73.98 6.99,75.56 7.62,76.2 7.62,77.79 8.57,78.74 8.57,81.28 8.89,81.6 10.16,81.6 10.79,82.23 11.75,82.23 12.38,82.87 C38.2
LINE_RP
  Top 0.305: R39.1 8.26,77.79 7.62,77.15 7.62,76.2 6.99,75.56 JP3.4
  Bottom 0.305: JP3.4 6.03,75.56 6.99,76.52 6.99,78.11 7.94,79.06 7.94,81.6 8.57,82.23 9.84,82.23 10.48,82.87 C37.2
LN
  Top 2.54: C49.2 43.9,27.86 L2.4
  Bottom 1.016: C55.2 45.09,29.21 44.45,28.57 C49.2 43.5,26.36 C61.2 43.5,23.5 43.81,23.18 54.61,23.18 55.24,22.54 55.24,17.78 56.2,16.83 61.91,16.83 62.23,16.51 SPK.P$2
LP
  Top 2.54: C48.1 57.78,27.94 57.78,34.92 57.64,35.07 L2.1
  Bottom 1.016: C54.1 56.52,29.21 57.15,28.57 C48.1 58.1,26.36 C60.1 58.1,23.5 58.74,22.86 60.01,22.86 62.23,20.64 SPK.P$5
LVL
  Bottom 0.406: APSU.P$6 41.27,19.68 41.91,19.05 T2.3 45.23,17.93 R57.1
N$1
  Top 0.305: BT1.64 38.5,102.31 39.66,103.48 J1.S
N$2
  Top 0.305: JP1.2 R1.1
N$3
  Top 0.305: JP1.4 R2.1
N$4
  Top 0.305: JP1.6 R3.1
N$5
  Top 0.305: JP1.8 R4.1
N$6
  Top 0.305: JP1.10 R5.1
N$7
  Top 0.305: JP1.12 R6.1
N$8
  Top 0.305: JP1.14 R7.1
N$9
  Top 0.305: JP1.16 R8.1
N$10
  Top 0.305: JP1.18 R9.1
N$11
  Top 0.305: JP1.20 R10.1
N$12
  Top 0.305: JP1.22 R11.1
N$13
  Top 0.305: JP1.24 R12.1
N$14
  Top 0.305: U1.2 34.98,113.93 35.24,113.67 35.24,109.86 35.56,109.54 C4.1
N$15
  Top 0.305: C4.2 36.83,111.76 35.88,112.71 35.88,114.3 34.95,115.23 U1.4
N$16
  Top 0.305: U1.5 35.25,115.88 36.51,114.62 36.51,113.03 36.83,112.71 38.1,112.71 38.73,112.08 C5.1
N$17
  Top 0.305: C79.1 72.39,60.96 73.03,60.33 73.03,56.52
  Top 0.406: IC7.40 64.45,60.01 64.14,59.69 63.82,60.01 IC7.39
  Top 1.27: L1.3 76.75,55.33 75.56,56.52 73.03,56.52 67.31,56.52 64.14,59.69
N$18
  Top 0.305: U1.18 26.63,114.58 26.35,114.3 26.35,112.39 29.21,109.54 C9.1 C10.1
N$19  (via drill 0.6)
  Top 0.305: C78.1 71.44,58.1 71.12,57.78 67.94,57.78 66.67,59.05 v66.67,59.69
  Top 0.406: IC7.35 61.28,60.01 61.59,59.69
  Top 1.27: L1.2 63.65,43.67 62.87,44.45 62.87,46.35 66.04,49.53 66.04,53.34 61.59,57.78 v61.59,58.42 61.59,59.69
  Bottom 0.305: v66.67,59.69 62.87,59.69 v61.59,58.42
N$20
  Top 0.305: U1.7 35.58,117.18 35.88,117.47 35.88,118.43 36.2,118.75 R18.1
N$21
  Top 0.406: IC6.3 10.48,44.13 7.62,46.99 R14.1 6.35,48.26 6.67,48.58 C41.2
N$23
  Top 0.406: C42.1 13.02,48.58 R16.2
N$24
  Top 0.406: IC6.2 11.75,44.45 10.79,45.4 R15.2 R16.1
N$25
  Top 0.305: U1.6 35.88,116.53 36.2,116.84 R17.1
N$26
  Top 0.305: C18.1 61.28,104.14 61.59,104.46 61.59,107.31 61.28,107.63 R25.1
N$27
  Top 0.305: C19.1 49.85,104.14 49.53,104.46 49.53,107.31 49.85,107.63 R26.1
N$28
  Top 0.305: C20.1 49.85,94.61 49.53,94.3 49.53,91.44 49.85,91.12 R27.1
N$29
  Top 0.305: C21.1 61.28,94.61 61.59,94.3 61.59,91.44 61.28,91.12 R28.1
N$30
  Top 0.305: C22.1 65.72,104.14 65.41,104.46 65.41,107.31 65.72,107.63 R29.1
N$31
  Top 0.305: C23.1 77.15,104.14 77.47,104.46 77.47,107.31 77.15,107.63 R30.1
N$32
  Top 0.305: IC4.2 73.98,104.46 74.3,104.78 R24.1 | R24.1 74.3,106.36 R30.2 | R24.1
N$33
  Top 0.305: IC4.6 68.9,104.46 68.58,104.78 R23.1 R29.2
N$34
  Top 0.305: IC3.13 58.1,94.3 58.42,93.98 R22.1 R28.2
N$35
  Top 0.305: IC3.9 53.02,94.3 52.7,93.98 R21.1 R27.2
N$36
  Top 0.305: IC3.6 53.02,104.46 52.7,104.78 R20.1 R26.2
N$37
  Top 0.305: IC3.2 58.1,104.46 58.42,104.78 R19.1 R25.2
N$38
  Top 0.305: C77.2 48.26,60.96 47.62,60.33 47.62,56.52
  Top 0.406: IC7.28 56.83,60.01 56.52,59.69 56.2,60.01 IC7.27
  Top 1.27: L2.2 46.15,55.67 46.99,56.52 47.62,56.52 53.34,56.52 56.52,59.69
N$39  (via drill 0.6)
  Top 0.305: IC3.1 v59.37,103.82 60.01,103.82 60.33,104.14 C24.2 R19.2
  Bottom 0.305: C24.2 60.33,104.14 60.01,103.82 v59.37,103.82
N$40  (via drill 0.6)
  Top 0.305: IC3.7 v51.75,103.82 51.12,103.82 50.8,104.14 C25.2
  Bottom 0.305: C25.2 50.8,104.14 51.12,103.82 v51.75,103.82
N$41  (via drill 0.6)
  Top 0.305: C26.2 50.8,94.62 51.12,94.93 v51.75,94.93 IC3.8
  Bottom 0.305: C26.2 50.8,94.61 51.12,94.93 v51.75,94.93
N$42  (via drill 0.6)
  Top 0.305: IC3.14 v59.37,94.93 60.01,94.93 60.32,94.62 R22.2
  Bottom 0.305: C27.2 60.33,94.61 60.01,94.93 v59.37,94.93
N$43  (via drill 0.61)
  Top 0.305: IC4.7 v67.63,103.82 66.99,103.82 66.67,104.14 R23.2
  Bottom 0.305: C29.2 v67.63,103.82
N$44  (via drill 0.61)
  Top 0.305: IC4.1 v75.25,103.82 75.88,103.82 76.2,104.14 R24.2
  Bottom 0.305: C28.2 v75.25,103.82
N$45  (via drill 0.6)
  Top 0.305: v67.63,94.3 C32.1 | C32.1 R34.1 | IC4.10 70.17,95.57 69.53,94.93 69.53,94.61 C32.1
  Bottom 0.305: R33.2 68.9,94.93 68.26,94.3 v67.63,94.3
N$46  (via drill 0.61)
  Top 0.305: C31.1 v46.67,118.75 69.85,118.75 70.48,118.11 70.48,113.67 72.07,112.08 72.07,110.49 72.71,109.86 IC4.3
  Bottom 0.305: R31.2 v46.67,118.75
N$47  (via drill 0.61)
  Top 0.305: C30.1 v46.67,116.84 46.99,116.84 48.26,118.11 69.53,118.11 69.85,117.79 69.85,113.35 70.8,112.39 70.8,110.49 70.17,109.86 IC4.5
  Bottom 0.305: R32.2 v46.67,116.84
N$48  (via drill 0.6)
  Top 0.406: IC6.1 13.02,43.5 | 13.02,43.5 13.02,44.77 12.7,45.09 R15.1 | v14.29,43.81 13.34,43.81 13.02,43.5 | IC6.6 10.48,35.88 v10.79,35.56
  Bottom 0.406: v10.79,35.56 10.79,43.5 11.11,43.81 v14.29,43.81
N$49
  Bottom 0.406: T1.3 43.01,15.58 T2.1 45.26,15.73 R38.1
N$50
  Top 0.406: R36.1 4.25,42.43 R58.1
N$52  (via drill 0.6)
  Top 0.305: C76.2 49.22,58.1 49.53,57.78 52.7,57.78 53.98,59.05 v53.98,59.69
  Top 0.406: IC7.32 59.37,60.01 59.05,59.69
  Top 1.27: L2.3 57.7,46.44 54.61,49.53 54.61,53.34 59.05,57.78 v59.05,58.42 59.05,59.69
  Bottom 0.305: v53.98,59.69 57.78,59.69 v59.05,58.42
N$55  (via drill 0.6)
  Top 0.305: v8.26,33.97 11.11,33.97 11.75,34.61 IC6.7
  Bottom 0.305: R35.2 42.55,4.45 41.27,5.71 39.37,5.71 34.61,10.48 16.83,10.48 15.56,11.75 10.48,11.75 9.84,12.38 9.84,33.34 9.21,33.97 v8.26,33.97
N$56
  Bottom 0.406: R35.1 50.48,4.45 51.12,5.08 D1.A
N$57
  Bottom 1.016: R43.2 C58.2
N$58
  Bottom 1.016: C59.1 R44.2
N$59
  Bottom 1.016: R45.2 C60.2
N$60
  Bottom 1.016: C61.1 R46.2
N$61
  Bottom 1.016: R47.2 C62.2
N$62
  Bottom 1.016: C63.1 R48.2
N$63
  Bottom 0.406: T1.1 40.81,9.99 41.27,9.53 C44.1 C45.1 C43.1 R37.1 49.53,9.52 50.48,10.48 50.97,10.48 D1.C
N$64
  Top 0.406: IC6.5 6.67,37.72 | 6.67,37.72 5.66,37.72 5.4,37.47 R36.2 | 6.67,37.72 6.55,37.84 R36.3 6.55,42.43 R59.2
N$65
  Top 0.305: IC7.44 68.2,62.29 C79.2
N$68
  Top 0.305: IC7.43 66.36,61.28 66.67,60.96 67.31,60.96 67.94,60.33 67.94,59.69 68.58,59.05 C78.2
N$72
  Top 0.305: C76.1 52.07,59.05 52.7,59.69 52.7,60.33 53.34,60.96 53.98,60.96 54.29,61.28 IC7.24
N$73  (via drill 0.6)
  Top 0.305: IC8.11 32.7,72.71 v33.02,73.03 | IC8.4 37.15,70.8 38.1,71.75 v38.1,73.03
  Bottom 0.305: C71.1 32.38,72.39 v33.02,73.03 33.02,73.66 33.66,74.3 37.47,74.3 38.1,73.66 v38.1,73.03
N$74  (via drill 0.6)
  Top 0.305: IC8.7 35.24,72.71 v35.56,73.03
  Bottom 0.305: R50.2 36.2,71.75 35.56,72.39 v35.56,73.03
N$75
  Top 0.305: IC7.23 52.45,62.29 C77.1
N$76  (via drill 0.6)
  Top 0.305: IC8.32 31.43,60.64 v31.75,60.33 | C83.1 43.49,61.28 v41.91,62.87 | C82.2 v19.68,59.05
  Top 0.406: IC8.39 35.88,60.64 v36.2,60.33 36.51,60.64 IC8.40
  Top 1.676: L3.3 38.65,43.9 38.1,44.45 38.1,56.52 36.2,58.42 v36.2,60.33
  Bottom 0.305: v31.75,60.33 31.75,61.59 | 31.75,61.59 36.2,61.59 | 36.2,61.59 v36.2,60.33 | v41.91,62.87 37.47,62.87 36.2,61.59 | v19.68,59.05 19.05,59.05 18.41,59.69 18.41,60.96 19.05,61.59 31.75,61.59
N$77  (via drill 0.6)
  Top 0.305: IC8.35 33.34,60.64 v33.02,60.33 | C81.1 44.45,59.05 45.09,59.69 45.09,62.23 44.45,62.87 v43.81,62.87 | C80.2 20.32,60.96 v19.68,60.33
  Top 0.406: IC8.27 28.26,60.64 v28.57,60.33 28.89,60.64 IC8.28
  Top 1.676: L3.2 27.1,44.66 26.04,45.72 26.04,55.88 28.57,58.42 v28.57,60.33
  Bottom 0.305: v33.02,60.33 33.02,59.05 | 33.02,59.05 28.57,59.05 v28.57,60.33 v19.68,60.33 | v43.81,62.87 42.55,61.59 38.1,61.59 37.47,60.96 37.47,59.69 36.83,59.05 33.02,59.05
N$78
  Top 0.406: IC8.44 39.05,61.91 40.01,60.96 C83.2
N$79
  Top 0.406: IC8.23 25.72,61.91 24.77,60.96 C80.1
N$80
  Top 0.406: IC8.24 26.35,61.28 24.13,59.05 C82.1
N$81
  Top 0.406: IC8.43 38.42,61.28 40.64,59.05 C81.2
N$82  (via drill 0.6)
  Top 0.305: IC8.20 26.99,72.71 v27.3,73.03
  Bottom 0.305: C68.2 26.04,71.75 v27.3,73.03
N$83  (via drill 0.6)
  Top 0.305: IC8.14 30.8,72.71 v31.11,73.03
  Bottom 0.305: C69.2 30.48,71.44 30.8,71.75 30.8,72.71 v31.11,73.03
N$84  (via drill 0.6)
  Top 0.305: IC8.15 30.16,72.71 v29.84,73.03
  Bottom 0.305: v29.84,73.03 28.57,73.03 27.94,72.39 C70.2
N$85  (via drill 0.6)
  Top 0.305: IC8.8 34.61,72.71 v34.29,73.03
  Bottom 0.305: R49.2 v34.29,73.03
N$86  (via drill 0.6)
  Top 0.305: IC8.1 39.05,70.8 40.64,72.39 v40.64,73.03
  Bottom 0.305: C85.2 38.73,71.44 39.69,71.44 40.64,72.39 v40.64,73.03 R52.2
N$87  (via drill 0.6)
  Top 0.305: IC8.22 25.72,72.07 v24.77,73.03
  Bottom 0.305: C84.2 24.13,72.39 v24.77,73.03 24.13,73.66 R51.2
N$88  (via drill 0.6)
  Top 0.305: IC7.11 60.64,72.71 v60.33,73.03
  Bottom 0.305: C90.1 v60.33,73.03
N$89  (via drill 0.6)
  Top 0.305: IC7.20 54.93,72.71 v54.61,73.03
  Bottom 0.305: C87.2 v54.61,73.03
N$90  (via drill 0.6)
  Top 0.305: IC7.14 58.74,72.71 v59.05,73.03
  Bottom 0.305: C88.2 58.74,71.75 58.74,72.71 v59.05,73.03
N$91  (via drill 0.6)
  Top 0.305: IC7.15 58.1,72.71 v57.78,73.03
  Bottom 0.305: C89.2 56.52,72.39 57.15,73.03 v57.78,73.03
N$92  (via drill 0.6)
  Top 0.305: IC7.7 63.18,72.71 v62.87,73.03
  Bottom 0.305: R54.2 64.14,71.75 v62.87,73.03
N$93  (via drill 0.6)
  Top 0.305: IC7.8 62.55,70.8 61.59,71.75 v61.59,73.03
  Bottom 0.305: R53.2 62.23,71.75 61.59,72.39 v61.59,73.03
N$94  (via drill 0.6)
  Top 0.305: IC7.1 66.99,72.71 v66.67,73.03
  Bottom 0.305: C92.2 66.67,72.07 v66.67,73.03 66.67,74.3 R56.2
N$95  (via drill 0.6)
  Top 0.305: IC7.22 53.4,69.79 52.7,70.48 v52.7,73.03
  Bottom 0.305: C91.2 v52.7,73.03 R55.2
PCM_CLK  (via drill 0.61)
  Top 0.305: BT1.7 29.74,108.06 25.08,112.71 25.08,113.35 v25.4,113.67 | U1.13 23.85,117.83 23.18,117.16 23.18,113.98 v22.86,113.67
  Bottom 0.305: v22.86,113.67 v25.4,113.67
PCM_OUT
  Top 0.305: BT1.9 27.74,108.15 23.81,112.08 23.81,116.84 24.13,117.16 27.91,117.16 U1.14
PCM_SYNC
  Top 0.305: BT1.8 28.74,108.1 24.45,112.39 24.45,116.2 24.77,116.52 U1.15
PIO0
  Top 0.305: BT1.23 12.88,104.31 12.38,103.82 12.38,101.92 12.06,101.6 R4.2
PIO1
  Top 0.305: BT1.24 13.46,103.31 13.02,102.87 13.02,100.97 R5.2
PIO2
  Top 0.305: BT1.25 14.05,102.31 13.65,101.92 13.65,99.06 R6.2
PIO3
  Top 0.305: BT1.30 12.86,97.31 12.38,96.84 12.38,95.25 R7.2
PIO4
  Top 0.305: BT1.31 13.13,96.31 13.02,96.2 13.02,94.93 12.38,94.3 12.38,92.71 R8.2
PIO5
  Top 0.305: BT1.32 14.04,95.31 13.65,94.93 13.65,94.61 13.02,93.98 13.02,92.39 12.38,91.76 12.38,90.17 R9.2
PIO6
  Top 0.305: BT1.33 14.3,94.31 13.65,93.66 13.65,92.08 13.02,91.44 13.02,89.85 12.38,89.22 12.38,87.63 R10.2
PIO7
  Top 0.305: BT1.34 14.57,93.31 14.29,93.03 14.29,91.76 13.65,91.12 13.65,89.53 13.02,88.9 13.02,85.73 R11.2
PIO10
  Top 0.305: SJ2.2 15.56,86.36 16.74,87.54 BT1.35
PIO11
  Top 0.305: BT1.36 17.74,85.58 SJ1.1
PIO12
  Top 0.305: SJ3.1 20,86.36 18.74,87.62 BT1.37
PIO15  (via drill 0.6, 0.61)
  Top 0.305: v25.4,114.94 25.74,115.23 U1.17 | BT1.40 21.74,93.51 21.59,93.66 16.83,93.66 16.51,93.98 16.51,98.74 v16.83,99.06
  Bottom 0.305: v16.83,99.06 13.97,99.06 13.34,99.69 13.34,108.27 13.97,108.9 20,108.9 22.86,111.76 26.04,111.76 26.67,112.39 26.67,114.3 26.04,114.94 v25.4,114.94
PWR  (via drill 0.6)
  Top 0.305: R12.2 12.38,81.28 13.97,82.87 13.97,87.95 v14.29,88.27 | BT1.43 24.74,94.91 v24.77,94.93
  Bottom 0.305: v14.29,88.27 14.92,88.9 14.92,90.81 15.88,91.76 24.18,91.76 BT1.43 24.74,94.91 v24.77,94.93
RN
  Top 2.54: C47.2 62.95,27.86 L1.4
  Bottom 1.016: C53.2 64.14,29.21 63.5,28.57 C47.2 62.55,26.36 C59.2 62.55,23.18 62.87,22.86 68.58,22.86 69.22,22.23 69.22,14.61 68.8,14.19 SPK.P$1
RP
  Top 1.016: SPK.P$6 75.88,19.68 76.2,20 C46.1
  Top 2.54: C46.1 76.83,27.94 76.83,34.92 73.66,34.92 73.81,35.07 L1.1
  Bottom 1.016: C58.1 77.15,26.36 C46.1 76.2,28.57 75.56,29.21 C52.1
SPI_CLK
  Top 0.305: BT1.11 25.74,109.2 22.54,112.39 16.19,112.39 15.88,112.71 JP2.6
SPI_CSB  (via drill 0.61)
  Top 0.305: BT1.13 23.74,108.97 22.54,110.17 18.73,110.17 v18.41,110.49
  Bottom 0.305: JP2.4 v18.41,110.49
SPI_MISO
  Top 0.305: BT1.14 22.74,108.7 22.23,109.22 17.46,109.22 17.14,109.54 17.14,110.81 16.83,111.12 13.97,111.12 JP2.10
SPI_MOSI
  Top 0.305: BT1.12 24.74,109.25 22.23,111.76 14.61,111.76 13.34,113.03 JP2.8
SPKR_LN  (via drill 0.61)
  Top 0.305: IC3.12 56.83,95.25 v57.15,94.93 | BT1.58 35.99,96.31 35.56,95.89 35.56,95.57 35.24,95.25 33.34,95.25 33.02,95.57 v33.02,96.2
  Bottom 0.305: v33.02,96.2 33.02,96.84 33.34,97.16 56.83,97.16 57.15,96.84 v57.15,94.93
SPKR_LP  (via drill 0.6, 0.61)
  Top 0.305: IC3.10 54.29,95.25 v53.98,94.93 | BT1.59 34.45,97.31 34.29,97.16 v34.29,96.2 | C41.1 10.47,51.43 11.11,52.07 11.11,67.31 14.61,70.8 21.59,70.8 v21.91,70.48
  Bottom 0.305: v34.29,96.2 34.61,96.52 53.66,96.52 53.98,96.2 v53.98,94.93 53.98,88.27 52.7,87 22.54,87 22.23,86.68 22.23,70.8 v21.91,70.48
SPKR_RN  (via drill 0.61)
  Top 0.305: IC3.5 54.29,103.5 v53.98,103.82 | BT1.60 36.3,98.31 35.88,98.74 v35.24,98.74
  Bottom 0.305: v35.24,98.74 35.56,98.42 47.31,98.42 47.62,98.74 47.62,101.28 48.26,101.92 53.66,101.92 53.98,102.23 v53.98,103.82
SPKR_RP  (via drill 0.61)
  Top 0.305: IC3.3 56.83,103.5 v57.15,103.82 | BT1.61 36.58,99.31 35.88,100.01 34.29,100.01 33.97,99.69 v33.97,98.74
  Bottom 0.305: v33.97,98.74 33.97,98.11 34.29,97.79 47.94,97.79 48.26,98.11 48.26,100.97 48.58,101.28 56.83,101.28 57.15,101.6 v57.15,103.82
SPKR_SN  (via drill 0.61)
  Top 0.305: R18.2 v41.27,118.75 C31.2
  Bottom 0.305: C16.1 v41.27,118.75
SPKR_SP  (via drill 0.61)
  Top 0.305: R17.2 v41.27,116.84 C30.2
  Bottom 0.305: C17.1 v41.27,116.84
SUBN
  Top 1.016: SPK.P$3 56.94,14.19 55.24,15.88 55.24,22.54 54.61,23.18 37.78,23.18 36.2,24.77 26.04,24.77 25.4,25.4 C51.2
  Top 2.54: L3.4 24.85,27.86 C51.2
  Bottom 1.016: C57.2 26.04,29.21 25.4,28.57 C51.2 24.45,26.36 C63.2
SUBP
  Top 1.016: SPK.P$4 58.03,23.57 56.83,24.77 38.42,24.77 38.1,25.08 C50.1
  Top 2.54: C50.1 38.73,27.94 38.73,34.92 36.55,34.92 L3.1
  Bottom 1.016: C62.1 39.05,26.36 C50.1 38.1,28.57 37.47,29.21 C56.1
VAMP  (via drill 0.6)
  Top 0.305: IC7.29 57.47,60.64 57.78,60.33 58.1,60.64 | IC7.30 58.1,60.64 | IC7.31 58.74,61.28 58.1,60.64 | IC7.36 61.91,61.28 62.23,60.96 | IC7.37 62.55,60.64 62.87,60.33 63.18,60.64 IC7.38 | IC8.30 30.16,60.64 | 30.16,60.64 30.48,60.33 30.8,60.64 IC8.31 | IC8.37 34.61,60.64 | 34.61,60.64 34.29,60.33 33.97,60.64 IC8.36 | IC8.38 35.24,61.28 34.61,60.64 | IC8.29 29.53,61.28 30.16,60.64 | VAMP.1 17.46,58.1 18.41,57.15
  Top 0.406: C101.+ 21.03,26.35 21.03,26.04
  Top 1.676: DPSU.P$6 21.03,26.04 21.03,44.2 21.59,44.77
  other vias: 27.94,54.61 29.21,54.61 29.21,55.88 36.2,54.61 34.92,54.61 34.92,55.88 40.01,54.61 41.27,54.61 41.27,55.88 40.01,55.88 24.13,55.88 22.86,55.88 22.86,54.61 24.13,54.61 50.16,54.61 51.44,54.61 52.7,54.61 70.48,54.61 69.22,54.61 67.94,54.61 22.23,44.13 22.23,45.4 20.95,45.4 20.95,44.13 41.27,44.13 41.27,45.4 51.12,44.77 52.39,44.77 53.66,44.77 54.93,44.77 54.93,46.04 53.66,46.04 52.39,46.04 51.12,46.04 70.17,44.45 71.44,44.45 72.71,44.45 73.98,44.45 73.98,45.72 72.71,45.72 71.44,45.72 70.17,45.72
  pour Top (isolate 0.305): 38.73,43.5 45.72,43.5 45.72,57.78 38.73,57.78
  pour Top (isolate 0.305): 25.4,43.5 25.4,57.78 17.78,57.78 17.78,43.5
  pour Top (isolate 0.305): 46.99,44.13 58.74,44.13 53.98,49.53 53.98,53.34 59.05,58.42 59.05,60.96 57.15,60.96 57.15,60.33 53.34,56.52 47.62,56.52 46.99,55.88
  pour Top (isolate 0.305): 61.28,43.81 76.2,43.81 76.2,55.24 75.56,55.88 67.94,55.88 64.14,59.69 64.14,60.96 61.59,60.96 61.59,58.42 66.67,53.34 66.67,49.53
  pour Top (isolate 0.305): 27.3,53.98 37.47,53.98 37.47,56.52 35.56,58.42 35.56,62.23 29.21,62.23 29.21,58.42 26.67,55.88 26.67,53.98
  pour Bottom (isolate 0.305): 22.23,53.34 29.84,53.34 29.84,57.15 22.23,57.15
  pour Bottom (isolate 0.305): 34.29,53.34 41.91,53.34 41.91,57.15 34.29,57.15
  pour Bottom: 50.8,55.24 71.12,55.24 71.12,53.98 49.53,53.98 49.53,55.24
  pour Bottom (isolate 0.305): 20,46.99 75.56,46.99 75.56,43.5 20,43.5